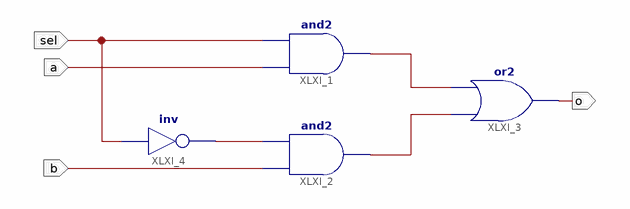
[diagram p0: schematic sheet 1]
// Xilinx ISE schematic mux2t1.sch (kintex7) as structural Verilog: 4 symbols, 4 ports
module mux2t1 (
  input  a,
  input  b,
  input  sel,
  output o
);

  wire XLXN_1, XLXN_2, XLXN_11;

  and XLXI_1 (XLXN_2, a, sel);
  and XLXI_2 (XLXN_11, b, XLXN_1);
  or XLXI_3 (o, XLXN_11, XLXN_2);
  not XLXI_4 (XLXN_1, sel);
endmodule
